# Altium schematic sheet AMU-S05-V00-CAN2.SchDoc: Isolated CANBUS2 3V3
size A3; DrawnBy: Jonn Dillon; DocumentNumber: 5; Revision: 01; SheetNumber: 5; SheetTotal: 12; Version: 01; Project: AMU 2020 (Sourced from BMS 2020); PageSetup: Record=PageOptions|CenterHorizontal=True|CenterVertical=True|PrintScale=0.97|XCorrection=1.00|YCorrection=1.00|PrintKind=0|BorderSize=5000000|LeftOffset=0|BottomOffset=0|Orientation=2|PaperLength=1000|PaperWidth=1000|Scale=100|PaperSource=7|PrintQuality=-4|MediaType=1|DitherType=10|PaperKind=A4|PrintScaleMode=1
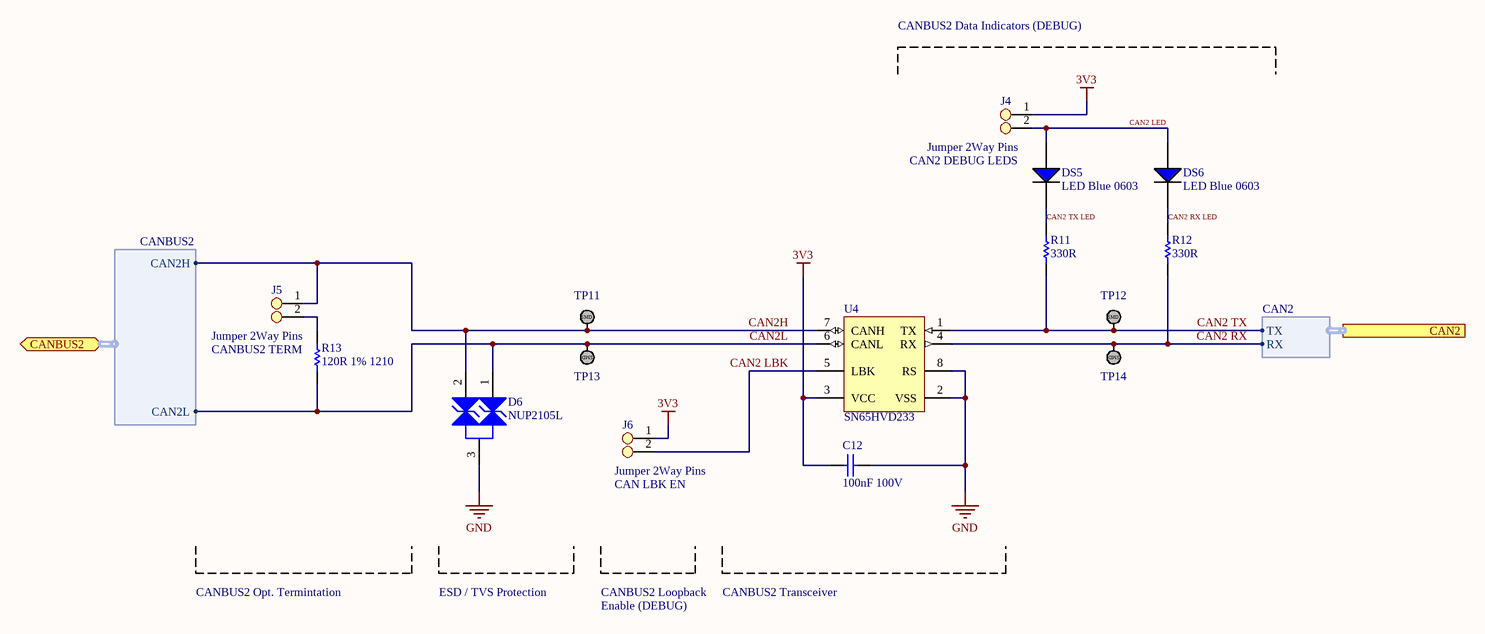
[diagram p0: AMU-S05-V00-CAN2.SchDoc]

## Parts
C12  100nF 100V  [Cap_Ceramic_0603]
D6  NUP2105L  [NUP2105L]
DS5  LED Blue 0603  [LED BLUE 0603]
DS6  LED Blue 0603  [LED BLUE 0603]
J4  Jumper 2Way Pins  [Jumper_2Way_Pin]
J5  Jumper 2Way Pins  [Jumper_2Way_Pin]
J6  Jumper 2Way Pins  [Jumper_2Way_Pin]
R11  330R  [Res_ThinFilm_0603]
R12  330R  [Res_ThinFilm_0603]
R13  120R 1% 1210  [Res_ThinFilm_1210]
TP11  TestPoint_SMD  [TestPointSMD]  (value not drawn)
TP12  TestPoint_SMD  [TestPointSMD]  (value not drawn)
TP13  TestPoint_SMD  [TestPointSMD]  (value not drawn)
TP14  TestPoint_SMD  [TestPointSMD]  (value not drawn)
U4  SN65HVD233  [SN65HVD233DR]

## Ports
CAN2 (harness CAN2), CANBUS2 (bidir, harness CANBUS2)

## Harnesses
CANBUS2: CAN2H, CAN2L
CAN2: RX, TX

## Nets
3V3: C12.2 J4.1 J6.1 U4.3(VCC)
GND: C12.1 D6.3 U4.2(VSS) U4.8(RS)
CAN2 LBK: J6.2 U4.5(LBK)
CAN2 LED: DS5.1(A) DS6.1(A) J4.2
CAN2 RX: R12.1 TP14.1 U4.4(RX) ; port CAN2.RX
CAN2 RX LED: DS6.2(C) R12.2
CAN2 TX: R11.1 TP12.1 U4.1(TX) ; port CAN2.TX
CAN2 TX LED: DS5.2(C) R11.2
CAN2H: D6.2 J5.1 TP11.1 U4.7(CANH) ; port CANBUS2.CAN2H
CAN2L: D6.1 R13.1 TP13.1 U4.6(CANL) ; port CANBUS2.CAN2L
NetJ5_2: J5.2 R13.2

## Notes on the sheet
- CANBUS2 Data Indicators (DEBUG)
- CAN2 DEBUG LEDS
- (near R13) CANBUS2 TERM
- (near J6) CAN LBK EN
- CANBUS2 Opt. Termintation
- ESD / TVS Protection
- CANBUS2 Loopback
- Enable (DEBUG)
- CANBUS2 Transceiver
- Revision History:
- Sheet Title:
- Rev
- Date
- Description
- Project:
- Size:
- Drawn By:
- A3
- Number:
- Revision:
- Sheet
- Version:
- of
- QUT Motorsport
- O-120, Gardens Point
- 2 George Street
- Brisbane, QLD 4000
- Australia
- Print Date:
- Print Time:
- File Name:
- (in symbol TestPoint_SMD) SMD

## Library data of the parts
C12 = 100nF 100V 5% X7R 0603: Capacitor, Ceramic, SMD, 100nF, 100V, 5%, X7R, 0603
J4-J6 = Jumper 2Way Side Pins
R11 R12 = 330R 5% 0603: Resistor, SMD, 330R, 0.1W, 5%, 0603
R13 = 120R 1% 1210: Resistor, SMD, 120R, 0.25W, 1%, 1210
D6 = NUP2105L: ComponentLink1Description: Datasheet; ComponentLink1URL: https://www.onsemi.cn/PowerSolutions/document/NUP2105L-D.PDF; Parameter 1: *; ComponentLink2Description: LCSC; ComponentLink2URL: https://lcsc.com/product-detail/TVS_ON-Semiconductor-NUP2105LT1G_C14486.html; ComponentLink3Description: Digikey; ComponentLink3URL: https://www.digikey.com.au/product-detail/en/on-semiconductor/SZNUP2105LT1G/SZNUP2105LT1GOSCT-ND/3487669
U4 = SN65HVD233: ComponentLink1Description: LCSC; ComponentLink1URL: https://lcsc.com/product-detail/CAN-ICs_Texas-Instruments_SN65HVD233DRG4_Texas-Instruments-Texas-Instruments-SN65HVD233DRG4_C61643.html; ComponentLink2Description: Digikey; ComponentLink2URL: https://www.digikey.com.au/product-detail/en/texas-instruments/SN65HVD233DR/296-35967-1-ND/4134960; ComponentLink3Description: Datasheet; ComponentLink3URL: https://www.ti.com/lit/ds/symlink/sn65hvd233.pdf?ts=1588560888178; ComponentLink4Description: Ti Product Page; ComponentLink4URL: https://www.ti.com/product/SN65HVD233